# Altium project electrodes_interface_pcb.PrjPcb
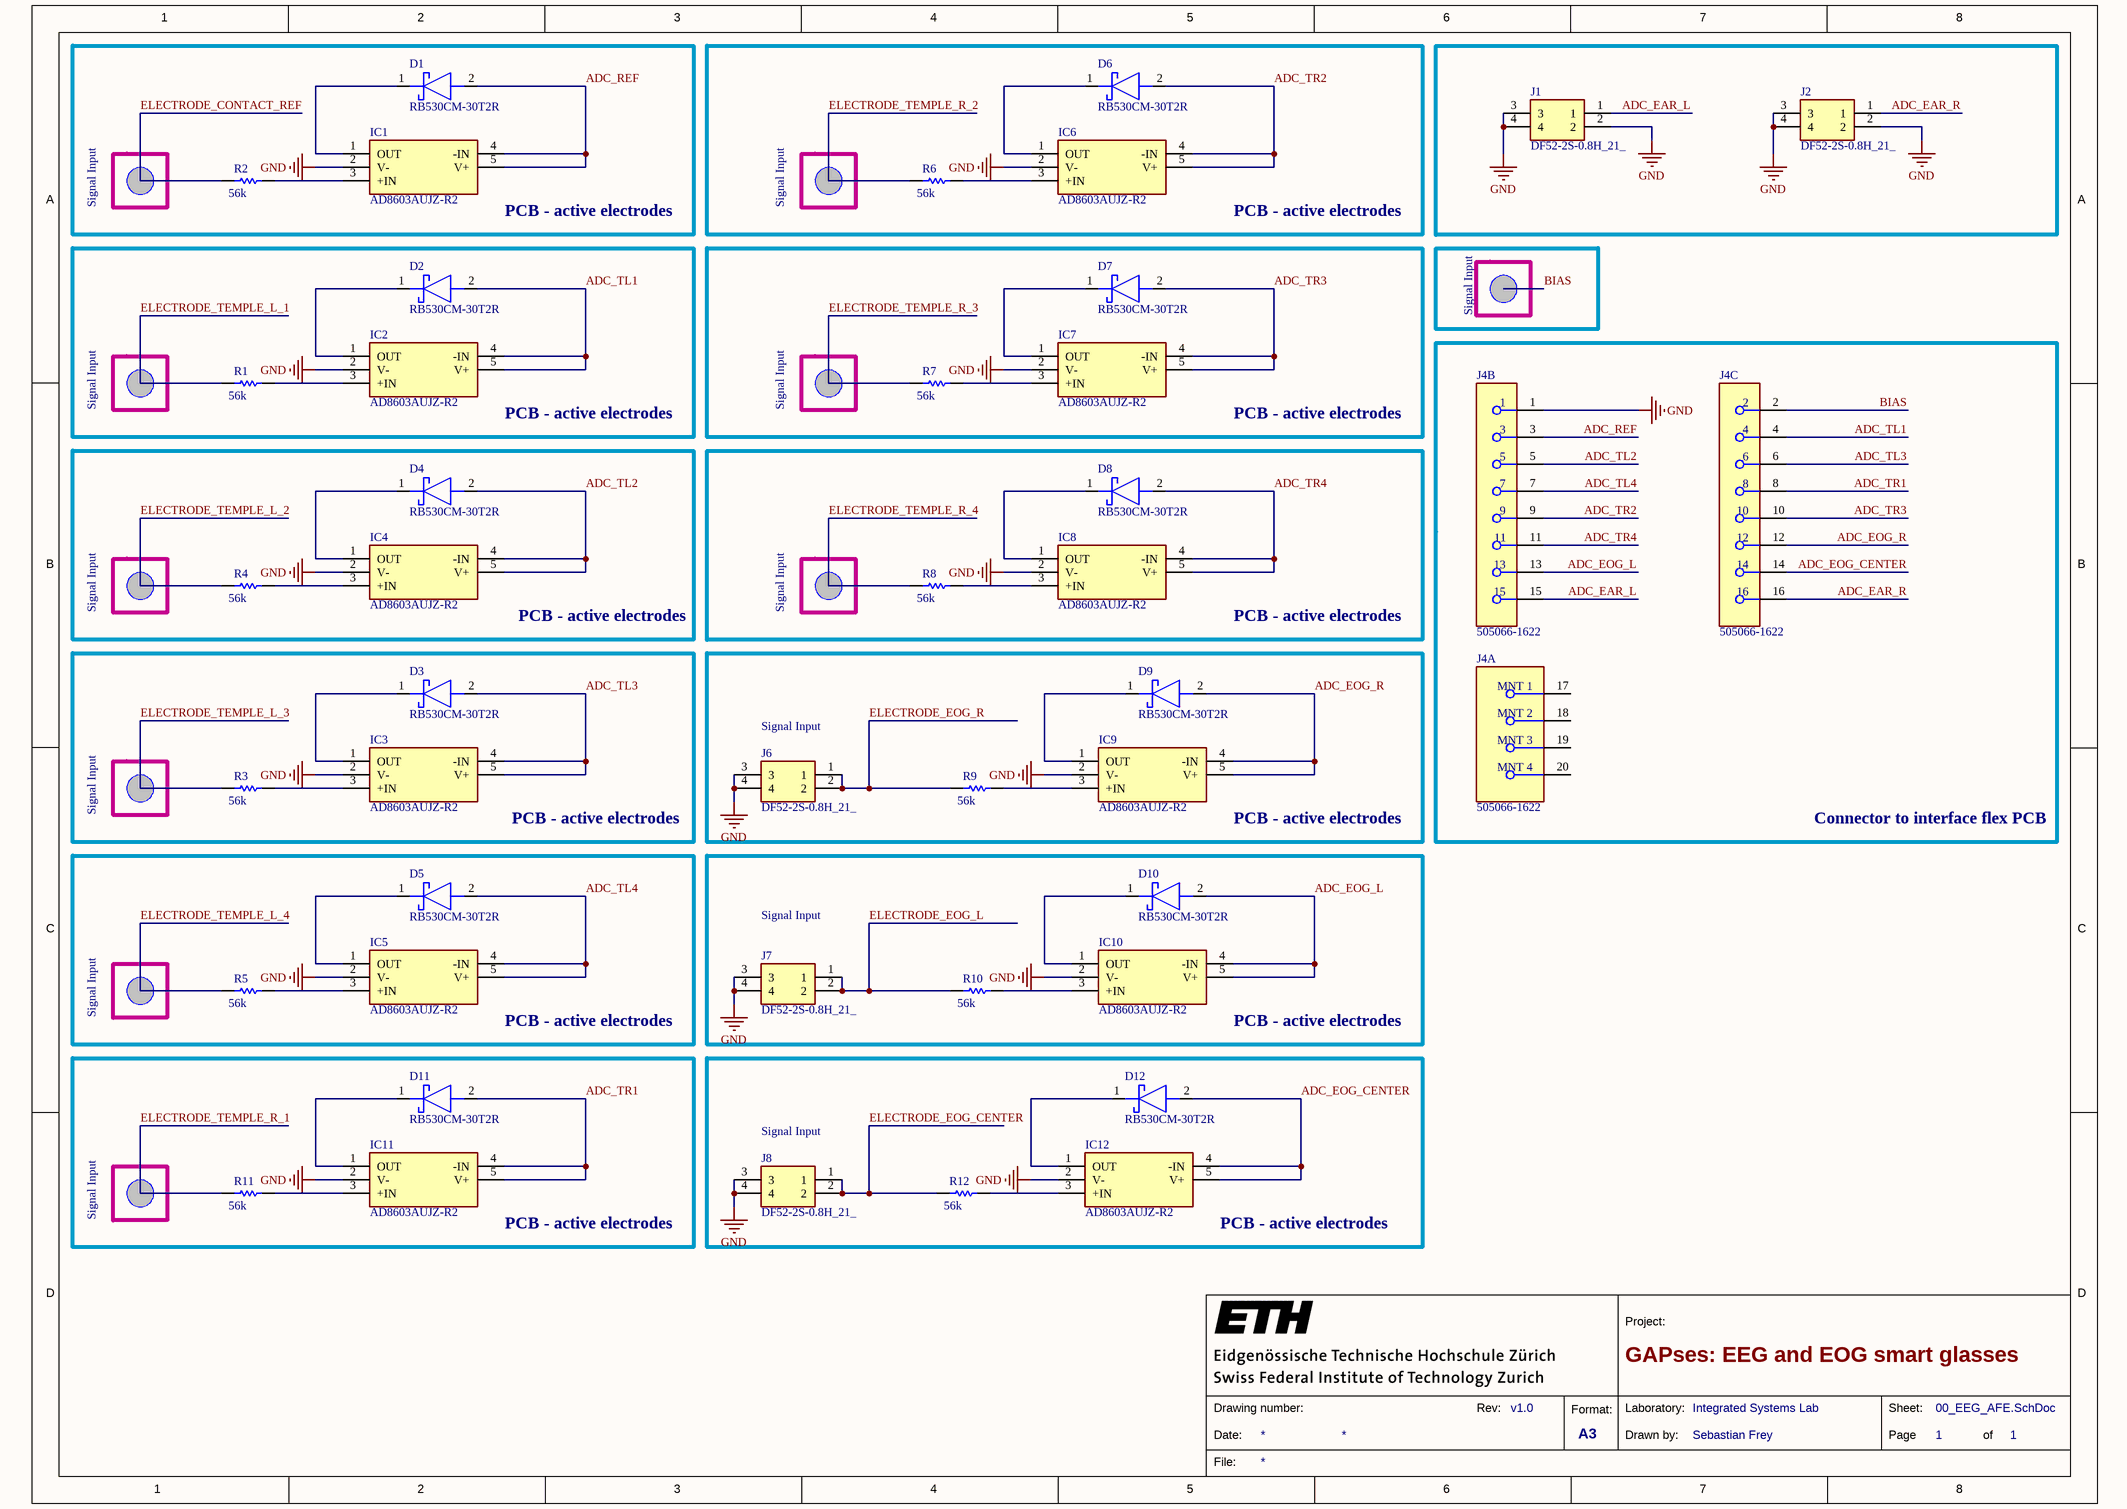
[diagram p0: 00_EEG_AFE.SchDoc]
revision: v1.1; sheetnumber: 1; sheettotal: 1; title: GAPses: EEG and EOG smart glasses
1 sheet, 42 parts. Net scope: global (net labels, ports and power ports of the same name join across sheets).
Board file: electrodes_interface_pcb.PcbDoc

## Sheet 00_EEG_AFE.SchDoc: GAPses: EEG and EOG smart glasses
size A3; DrawnBy: Sebastian Frey; Organization: Integrated Systems Lab; Revision: v1.0; SheetNumber: 1; SheetTotal: 1

### Parts
D1  RB530CM-30T2R  [RB886CST2RA]
D2  RB530CM-30T2R  [RB886CST2RA]
D3  RB530CM-30T2R  [RB886CST2RA]
D4  RB530CM-30T2R  [RB886CST2RA]
D5  RB530CM-30T2R  [RB886CST2RA]
D6  RB530CM-30T2R  [RB886CST2RA]
D7  RB530CM-30T2R  [RB886CST2RA]
D8  RB530CM-30T2R  [RB886CST2RA]
D9  RB530CM-30T2R  [RB886CST2RA]
D10  RB530CM-30T2R  [RB886CST2RA]
D11  RB530CM-30T2R  [RB886CST2RA]
D12  RB530CM-30T2R  [RB886CST2RA]
IC1  AD8603AUJZ-R2  [SOT95P280X100-5N]
IC2  AD8603AUJZ-R2  [SOT95P280X100-5N]
IC3  AD8603AUJZ-R2  [SOT95P280X100-5N]
IC4  AD8603AUJZ-R2  [SOT95P280X100-5N]
IC5  AD8603AUJZ-R2  [SOT95P280X100-5N]
IC6  AD8603AUJZ-R2  [SOT95P280X100-5N]
IC7  AD8603AUJZ-R2  [SOT95P280X100-5N]
IC8  AD8603AUJZ-R2  [SOT95P280X100-5N]
IC9  AD8603AUJZ-R2  [SOT95P280X100-5N]
IC10  AD8603AUJZ-R2  [SOT95P280X100-5N]
IC11  AD8603AUJZ-R2  [SOT95P280X100-5N]
IC12  AD8603AUJZ-R2  [SOT95P280X100-5N]
J1  DF52-2S-0.8H_21_  [DF522S08H21]
J2  DF52-2S-0.8H_21_  [DF522S08H21]
J4  505066-1622  [FP-505066-1622-MFG]  (parts A,B,C of 3)
J6  DF52-2S-0.8H_21_  [DF522S08H21]
J7  DF52-2S-0.8H_21_  [DF522S08H21]
J8  DF52-2S-0.8H_21_  [DF522S08H21]
R1  Resistance: 56k  [RESC1005X40X25LL05T10]  (hidden comment: RC0402JR-0756KL)
R2  Resistance: 56k  [RESC1005X40X25LL05T10]  (hidden comment: RC0402JR-0756KL)
R3  Resistance: 56k  [RESC1005X40X25LL05T10]  (hidden comment: RC0402JR-0756KL)
R4  Resistance: 56k  [RESC1005X40X25LL05T10]  (hidden comment: RC0402JR-0756KL)
R5  Resistance: 56k  [RESC1005X40X25LL05T10]  (hidden comment: RC0402JR-0756KL)
R6  Resistance: 56k  [RESC1005X40X25LL05T10]  (hidden comment: RC0402JR-0756KL)
R7  Resistance: 56k  [RESC1005X40X25LL05T10]  (hidden comment: RC0402JR-0756KL)
R8  Resistance: 56k  [RESC1005X40X25LL05T10]  (hidden comment: RC0402JR-0756KL)
R9  Resistance: 56k  [RESC1005X40X25LL05T10]  (hidden comment: RC0402JR-0756KL)
R10  Resistance: 56k  [RESC1005X40X25LL05T10]  (hidden comment: RC0402JR-0756KL)
R11  Resistance: 56k  [RESC1005X40X25LL05T10]  (hidden comment: RC0402JR-0756KL)
R12  Resistance: 56k  [RESC1005X40X25LL05T10]  (hidden comment: RC0402JR-0756KL)

### Blocks framed on the sheet
PCB - active electrodes: D1 IC1 R2
PCB - active electrodes: D6 IC6 R6
PCB - active electrodes: D2 IC2 R1
PCB - active electrodes: D7 IC7 R7
Connector to interface flex PCB: J4
PCB - active electrodes: D4 IC4 R4
PCB - active electrodes: D8 IC8 R8
PCB - active electrodes: D3 IC3 R3
PCB - active electrodes: D9 IC9 J6 R9
PCB - active electrodes: D5 IC5 R5
PCB - active electrodes: D10 IC10 J7 R10
PCB - active electrodes: D11 IC11 R11
PCB - active electrodes: D12 IC12 J8 R12

### Nets
GND: IC1.2(V-) IC2.2(V-) IC3.2(V-) IC4.2(V-) IC5.2(V-) IC6.2(V-) IC7.2(V-) IC8.2(V-) IC9.2(V-) IC10.2(V-) IC11.2(V-) IC12.2(V-) J1.2 J1.3 J1.4 J2.2 J2.3 J2.4 J4.1 J6.3 J6.4 J7.3 J7.4 J8.3 J8.4
ADC_EAR_L: J1.1 J4.15
ADC_EAR_R: J2.1 J4.16
ADC_EOG_CENTER: D12.2(A) IC12.4(-IN) IC12.5(V+) J4.14
ADC_EOG_L: D10.2(A) IC10.4(-IN) IC10.5(V+) J4.13
ADC_EOG_R: D9.2(A) IC9.4(-IN) IC9.5(V+) J4.12
ADC_REF: D1.2(A) IC1.4(-IN) IC1.5(V+) J4.3
ADC_TL1: D2.2(A) IC2.4(-IN) IC2.5(V+) J4.4
ADC_TL2: D4.2(A) IC4.4(-IN) IC4.5(V+) J4.5
ADC_TL3: D3.2(A) IC3.4(-IN) IC3.5(V+) J4.6
ADC_TL4: D5.2(A) IC5.4(-IN) IC5.5(V+) J4.7
ADC_TR1: D11.2(A) IC11.4(-IN) IC11.5(V+) J4.8
ADC_TR2: D6.2(A) IC6.4(-IN) IC6.5(V+) J4.9
ADC_TR3: D7.2(A) IC7.4(-IN) IC7.5(V+) J4.10
ADC_TR4: D8.2(A) IC8.4(-IN) IC8.5(V+) J4.11
BIAS: J4.2
ELECTRODE_CONTACT_REF: R2.1
ELECTRODE_EOG_CENTER: J8.1 J8.2 R12.1
ELECTRODE_EOG_L: J7.1 J7.2 R10.1
ELECTRODE_EOG_R: J6.1 J6.2 R9.1
ELECTRODE_TEMPLE_L_1: R1.1
ELECTRODE_TEMPLE_L_2: R4.1
ELECTRODE_TEMPLE_L_3: R3.1
ELECTRODE_TEMPLE_L_4: R5.1
ELECTRODE_TEMPLE_R_1: R11.1
ELECTRODE_TEMPLE_R_2: R6.1
ELECTRODE_TEMPLE_R_3: R7.1
ELECTRODE_TEMPLE_R_4: R8.1
NetD1_1: D1.1(K) IC1.1(OUT)
NetD2_1: D2.1(K) IC2.1(OUT)
NetD3_1: D3.1(K) IC3.1(OUT)
NetD4_1: D4.1(K) IC4.1(OUT)
NetD5_1: D5.1(K) IC5.1(OUT)
NetD6_1: D6.1(K) IC6.1(OUT)
NetD7_1: D7.1(K) IC7.1(OUT)
NetD8_1: D8.1(K) IC8.1(OUT)
NetD9_1: D9.1(K) IC9.1(OUT)
NetD10_1: D10.1(K) IC10.1(OUT)
NetD11_1: D11.1(K) IC11.1(OUT)
NetD12_1: D12.1(K) IC12.1(OUT)
NetIC1_3: IC1.3(+IN) R2.2
NetIC2_3: IC2.3(+IN) R1.2
NetIC3_3: IC3.3(+IN) R3.2
NetIC4_3: IC4.3(+IN) R4.2
NetIC5_3: IC5.3(+IN) R5.2
NetIC6_3: IC6.3(+IN) R6.2
NetIC7_3: IC7.3(+IN) R7.2
NetIC8_3: IC8.3(+IN) R8.2
NetIC9_3: IC9.3(+IN) R9.2
NetIC10_3: IC10.3(+IN) R10.2
NetIC11_3: IC11.3(+IN) R11.2
NetIC12_3: IC12.3(+IN) R12.2

Not connected (* = marked no-connect by the designer): J4 17(MNT_1) 18(MNT_2) 19(MNT_3) 20(MNT_4)

### Notes on the sheet
- Signal Input
- (near J6) Signal Input
- (near J8) Signal Input
- 1
- 2
- 3
- 4
- 5
- 6
- 7
- 8
- A
- B
- C
- D
- Project:
- Date:
- Drawing number:
- Rev:
- Format:
- A3
- Drawn by:
- Laboratory:
- Page
- Sheet:
- of
- File:

### Library data of the parts
D1-D12 = RB530CM-30T2R: Schottky Diode; Manufacturer_Name: ROHM Semiconductor; Datasheet Link: https://fscdn.rohm.com/en/products/databook/datasheet/discrete/diode/schottky_barrier/rb530cm-30t2r-e.pdf; Height: 0.4mm; Manufacturer_Part_Number: RB530CM-30T2R; Mouser Part Number: 755-RB530CM-30T2R; Mouser Price/Stock: https://www.mouser.co.uk/ProductDetail/ROHM-Semiconductor/RB530CM-30T2R?qs=4v%252BiZTmLVHEj8J7gVIxl2g%3D%3D
IC1-IC12 = AD8603AUJZ-R2: Integrated Circuit; Manufacturer_Name: Analog Devices; Datasheet Link: http://componentsearchengine.com/Datasheets/3/AD8603AUJZ-R2.pdf; Height: 1mm; Manufacturer_Part_Number: AD8603AUJZ-R2
J1 J2 J6-J8 = DF52-2S-0.8H_21_: Connector; Manufacturer_Name: Hirose; Manufacturer_Part_Number: DF52-2S-0.8H(21); Datasheet Link: https://datasheet.datasheetarchive.com/originals/distributors/DKDS-30/591726.pdf; Height: 1mm; Mouser Part Number: 798-DF52-2S-0.8H21; Mouser Price/Stock: https://www.mouser.co.uk/ProductDetail/Hirose-Connector/DF52-2S-0.8H21?qs=%2FKR40Cd6GUpAHUMGMtWbig%3D%3D
J4 = CMP-04776-000161-1: CONN RCPT 16POS SMD GOLD
R1-R12 = CMP-2002-08022-1: Manufacturer: Yageo / Phycomp; Part Number: RC0402JR-0756KL

## Assembly variants
Only fitted: all parts fitted